# EAGLE schematic untitled (EAGLE 9.0.1)
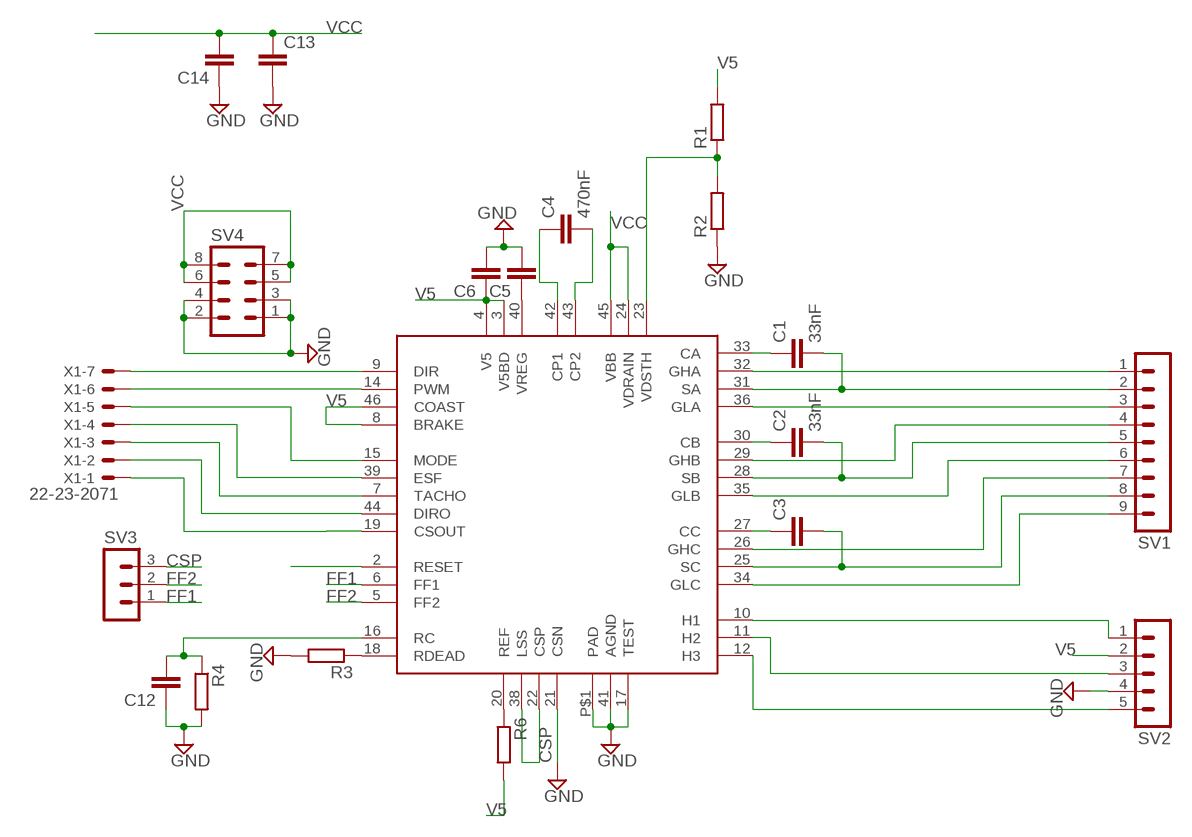
[diagram p0: schematic, sheet 1]

## Parts
C1  33nF  C-EUC0603  [C0603]
C2  33nF  C-EUC0603  [C0603]
C3  C-EUC0603  [C0603]
C4  470nF  C-EUC0805  [C0805]
C5  C-EUC1206  [C1206]
C6  C-EUC1206  [C1206]
C12  C-EUC1206  [C1206]
C13  C-EU025-050X050  [C025-050X050]
C14  C-EUC1206  [C1206]
R1  R-EU_R1206  [R1206]
R2  R-EU_R1206  [R1206]
R3  R-EU_R1206  [R1206]
R4  R-EU_R1206  [R1206]
R6  R-EU_R1206  [R1206]
SV1  MA09-1  [MA09-1]
SV2  MA05-1  [MA05-1]
SV3  MA03-1  [MA03-1]
SV4  MA04-2  [MA04-2]
U$1  A3930  [TQFP48]
X1  22-23-2071  [22-23-2071]

## Nets
CSP: SV3.3 U$1.22(CSP) U$1.38(LSS)
FF1: SV3.1 U$1.6(FF1)
FF2: SV3.2 U$1.5(FF2)
GND: C5.2 C6.2 C12.1 C13.2 C14.1 R2.1 R3.2 R4.2 SV2.4 SV4.1 SV4.2 SV4.3 SV4.4 U$1.17(TEST) U$1.21(CSN) U$1.41(AGND) U$1.P$1(PAD)
N$1: SV1.1 U$1.32(GHA)
N$2: C1.2 SV1.2 U$1.31(SA)
N$3: SV1.3 U$1.36(GLA)
N$4: SV1.4 U$1.29(GHB)
N$5: C2.2 SV1.5 U$1.28(SB)
N$6: SV1.6 U$1.35(GLB)
N$7: SV1.7 U$1.26(GHC)
N$8: C3.2 SV1.8 U$1.25(SC)
N$9: SV1.9 U$1.34(GLC)
N$10: C1.1 U$1.33(CA)
N$11: C2.1 U$1.30(CB)
N$12: C3.1 U$1.27(CC)
N$13: C4.1 U$1.42(CP1)
N$14: C4.2 U$1.43(CP2)
N$15: SV2.1 U$1.10(H1)
N$16: SV2.3 U$1.11(H2)
N$17: SV2.5 U$1.12(H3)
N$18: R1.1 R2.2 U$1.23(VDSTH)
N$19: U$1.2(RESET)
N$20: C5.1 U$1.40(VREG)
N$21: U$1.9(DIR) X1.7
N$22: R3.1 U$1.18(RDEAD)
N$23: C12.2 R4.1 U$1.16(RC)
N$24: U$1.14(PWM) X1.6
N$25: R6.1 U$1.20(REF)
N$26: U$1.15(MODE) X1.5
N$27: U$1.39(ESF) X1.4
N$28: U$1.7(TACHO) X1.3
N$29: U$1.44(DIRO) X1.2
N$30: U$1.19(CSOUT) X1.1
V5: C6.1 R1.2 R6.2 SV2.2 U$1.3(V5BD) U$1.4(V5) U$1.8(BRAKE) U$1.46(COAST)
VCC: C13.1 C14.2 SV4.5 SV4.6 SV4.7 SV4.8 U$1.24(VDRAIN) U$1.45(VBB)

## Library data of the parts
C1-C6 C12-C14 = resistor:C-EU: CAPACITOR, European symbol
R1-R4 R6 = resistor:R-EU_: RESISTOR, European symbol
SV1 = con-lstb:MA09-1: PIN HEADER; OC_FARNELL: unknown; OC_NEWARK: unknown
SV2 = con-lstb:MA05-1: PIN HEADER; OC_FARNELL: unknown; OC_NEWARK: unknown
SV3 = con-lstb:MA03-1: PIN HEADER; OC_FARNELL: unknown; OC_NEWARK: unknown
SV4 = con-lstb:MA04-2: PIN HEADER; OC_FARNELL: unknown; OC_NEWARK: unknown
U$1 = allegroM:A3930
X1 = con-molex:22-23-2071: .100" (2.54mm) Center Header - 7 Pin; MF: MOLEX; MPN: 22-23-2071; OC_FARNELL: 1654534; OC_NEWARK: 56H0445